# Altium schematic sheet PROC106B_FLASH_USB_TO_UART.SchDoc: FLASH&USB_TO_UART
size 431 x 279 mm; Date: Not shown in title block; ApprovedBy: Not shown in title block; CheckedBy: Not shown in title block; Author: Not shown in title block; CompanyName: Not shown in title block; DrawnBy: Antony/Anand Ram; Engineer: Not shown in title block; Organization: Not shown in title block; Address1: Not shown in title block; Address2: Not shown in title block; Address3: Not shown in title block; Address4: Not shown in title block; DocumentNumber: 6; Revision: Use project parameter SCH_Rev; SheetNumber: 6; SheetTotal: 12; PageSetup: Record=PageOptions|CenterHorizontal=True|CenterVertical=True|PrintScale=1.00|XCorrection=1.00|YCorrection=1.00|PrintKind=0|BorderSize=5000000|LeftOffset=0|BottomOffset=0|Orientation=2|PaperLength=1000|PaperWidth=1000|Scale=100|PaperSource=15|PrintQuality=600|MediaType=1|DitherType=10|PaperKind=Letter|PrintScaleMode=1; CurrentTime: Not shown in title block; CurrentDate: Not shown in title block; Time: Not shown in title block; DocumentFullPathAndName: Not shown in title block; DocumentName: Not shown in title block; ModifiedDate: Not shown in title block; ImagePath: Not shown in title block
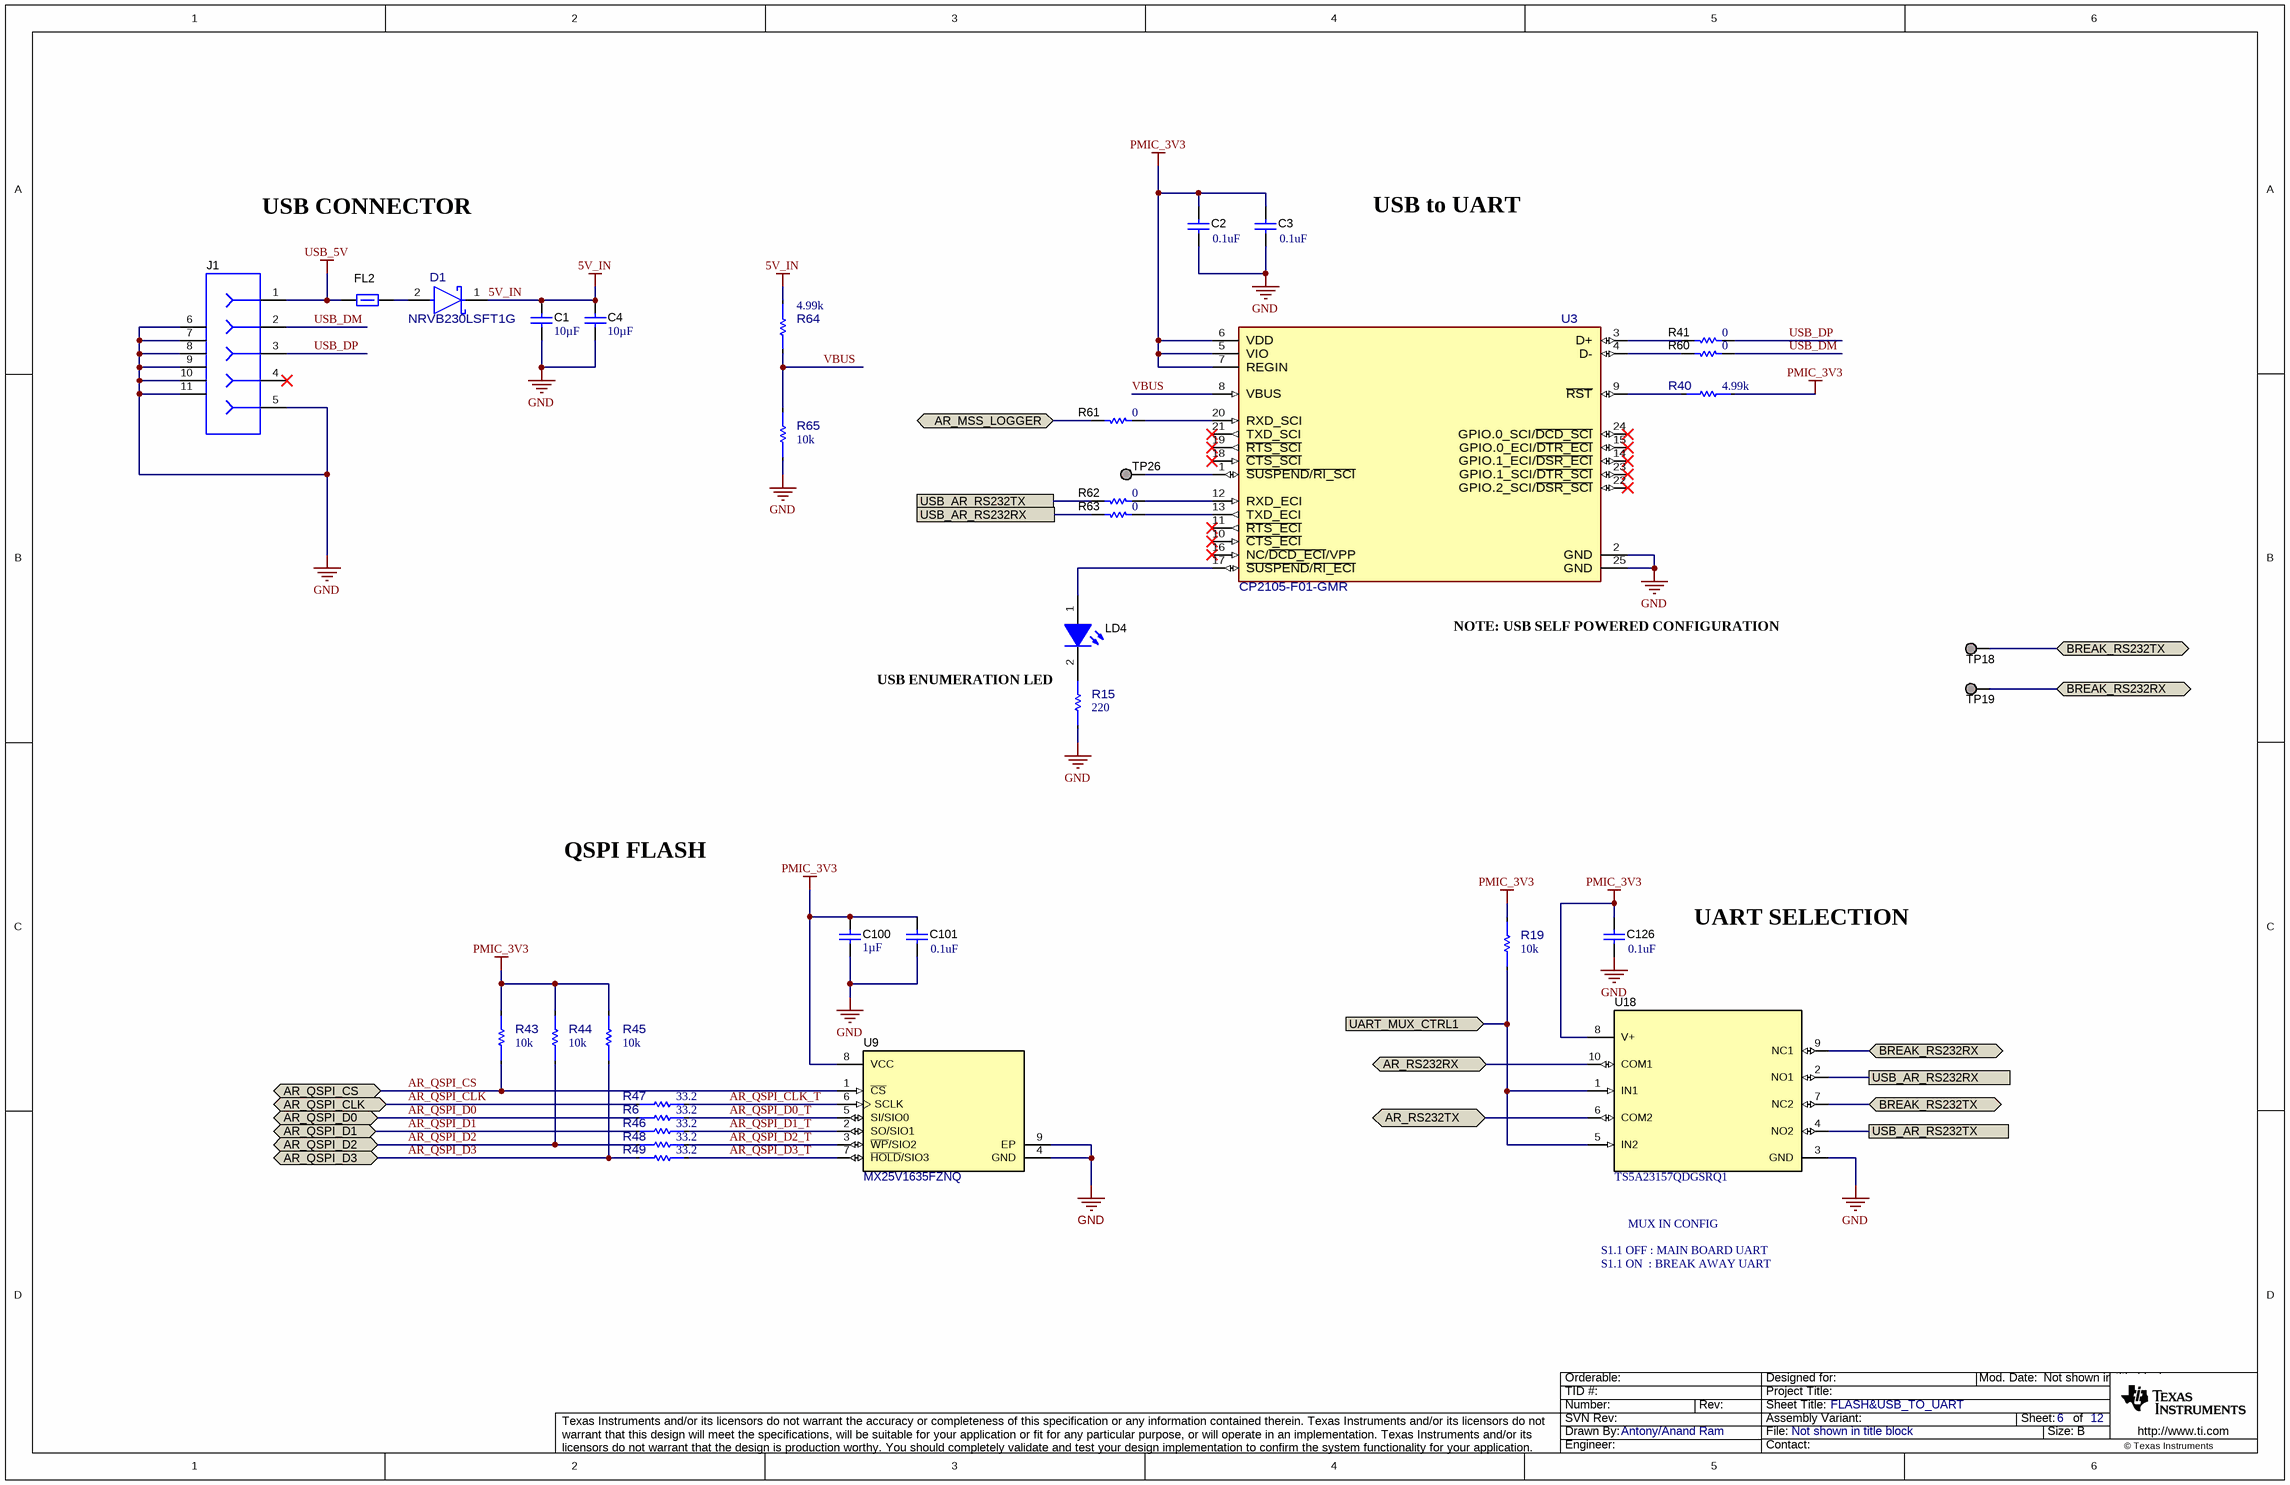
[diagram p0: PROC106B_FLASH_USB_TO_UART.SchDoc]

## Parts
C1  Cap_F: 10µF  [0805L]  (hidden comment: GCM21BR71A106KE22L)
C2  ValueDisplayed: 0.1uF  [0402L]  (hidden comment: GCM155R71C104KA55D)
C3  ValueDisplayed: 0.1uF  [0402L]  (hidden comment: GCM155R71C104KA55D)
C4  Cap_F: 10µF  [0805L]  (hidden comment: GCM21BR71A106KE22L)
C100  Cap_F: 1µF  [0603L]  (hidden comment: GCM188R71C105KA64D)
C101  ValueDisplayed: 0.1uF  [0402L]  (hidden comment: GCM155R71C104KA55D)
C126  ValueDisplayed: 0.1uF  [0402L]  (hidden comment: GCM155R71C104KA55D)
D1  NRVB230LSFT1G  [FP-NRVB230LSFT1G_SOD-123F-MFG]
FL2  BLM15PD300SZ1D  [0402L]  (value not drawn)
J1  105017-0001  [CONN_105017-0001]  (value not drawn)
LD4  APHHS1005CGCK  [APHHS1005_Green]  (value not drawn)
R6  value 33.2  [FP-ERJ-1GNF33R2C_0201-IPC_C]  (hidden comment: ERJ-1GNF33R2C)
R15  value 220  [FP-ERJ-1GNJ221C_0201-IPC_C]  (hidden comment: ERJ-1GNJ221C)
R19  value 10k  [FP-ERA-1AEB103C_0201-IPC_C]  (hidden comment: ERA-1AEB103C)
R40  value 4.99k  [FP-ERJ-1GNF4991C_0201-IPC_C]  (hidden comment: ERJ-1GNF4991C)
R41  ValueDisplayed: 0  [0201L]  (hidden comment: ERJ-1GN0R00C)
R43  value 10k  [FP-ERA-1AEB103C_0201-IPC_C]  (hidden comment: ERA-1AEB103C)
R44  value 10k  [FP-ERA-1AEB103C_0201-IPC_C]  (hidden comment: ERA-1AEB103C)
R45  value 10k  [FP-ERA-1AEB103C_0201-IPC_C]  (hidden comment: ERA-1AEB103C)
R46  value 33.2  [FP-ERJ-1GNF33R2C_0201-IPC_C]  (hidden comment: ERJ-1GNF33R2C)
R47  value 33.2  [FP-ERJ-1GNF33R2C_0201-IPC_C]  (hidden comment: ERJ-1GNF33R2C)
R48  value 33.2  [FP-ERJ-1GNF33R2C_0201-IPC_C]  (hidden comment: ERJ-1GNF33R2C)
R49  value 33.2  [FP-ERJ-1GNF33R2C_0201-IPC_C]  (hidden comment: ERJ-1GNF33R2C)
R60  ValueDisplayed: 0  [0201L]  (hidden comment: ERJ-1GN0R00C)
R61  ValueDisplayed: 0  [0201L]  (hidden comment: ERJ-1GN0R00C)
R62  ValueDisplayed: 0  [0201L]  (hidden comment: ERJ-1GN0R00C)
R63  ValueDisplayed: 0  [0201L]  (hidden comment: ERJ-1GN0R00C)
R64  value 4.99k  [FP-ERJ-1GNF4991C_0201-IPC_C]  (hidden comment: ERJ-1GNF4991C)
R65  value 10k  [FP-ERA-1AEB103C_0201-IPC_C]  (hidden comment: ERA-1AEB103C)
TP18  TESTPOINT  [TP_25MIL-SMT]  (value not drawn)  (no BOM)
TP19  TESTPOINT  [TP_25MIL-SMT]  (value not drawn)  (no BOM)
TP26  TESTPOINT  [TP_25MIL-SMT]  (value not drawn)  (no BOM)
U3  CP2105-F01-GMR  [FP-CP2105-F01-GMR_QFN24-EP-IPC_A]
U9  MX25V1635FZNQ  [WSON-8L_6x5MM_EP]
U18  TS5A23157QDGSRQ1  [DGS0010A_L]

## Ports
AR_MSS_LOGGER (bidir), AR_QSPI_CLK (bidir), AR_QSPI_CS (bidir), AR_QSPI_D0 (bidir), AR_QSPI_D1 (bidir), AR_QSPI_D2 (bidir), AR_QSPI_D3 (bidir), AR_RS232RX (bidir), AR_RS232TX (bidir), BREAK_RS232RX (bidir), BREAK_RS232TX (bidir), UART_MUX_CTRL1 (in), USB_AR_RS232RX, USB_AR_RS232TX

## Nets
5V_IN: C1.2 C4.1 D1.1(CATHODE) R64.1
GND: C1.1 C2.2 C3.2 C4.2 C100.1 C101.1 C126.1 J1.5 J1.6 J1.7 J1.8 J1.9 J1.10 J1.11 R15.1 R65.1 U3.2(GND) U3.25(GND) U9.4(GND) U9.9(EP) U18.3(GND)
PMIC_3V3: C2.1 C3.1 C100.2 C101.2 C126.2 R19.2 R40.1 R43.2 R44.2 R45.2 U3.5(VIO) U3.6(VDD) U3.7(REGIN) U9.8(VCC) U18.8(V+)
USB_5V: FL2.1 J1.1
AR_MSS_LOGGER: R61.1 ; port AR_MSS_LOGGER
AR_QSPI_CLK: R47.1 ; port AR_QSPI_CLK
AR_QSPI_CLK_T: R47.2 U9.6(SCLK)
AR_QSPI_CS: R43.1 U9.1(~{CS}) ; port AR_QSPI_CS
AR_QSPI_D0: R6.1 ; port AR_QSPI_D0
AR_QSPI_D0_T: R6.2 U9.5(SI/SIO0)
AR_QSPI_D1: R46.1 ; port AR_QSPI_D1
AR_QSPI_D1_T: R46.2 U9.2(SO/SIO1)
AR_QSPI_D2: R44.1 R48.1 ; port AR_QSPI_D2
AR_QSPI_D2_T: R48.2 U9.3(~{WP}/SIO2)
AR_QSPI_D3: R45.1 R49.1 ; port AR_QSPI_D3
AR_QSPI_D3_T: R49.2 U9.7(~{HOLD}/SIO3)
AR_RS232RX: U18.10(COM1) ; port AR_RS232RX
AR_RS232TX: U18.6(COM2) ; port AR_RS232TX
BREAK_RS232RX: TP19.1 U18.9(NC1) ; port BREAK_RS232RX
BREAK_RS232TX: TP18.1 U18.7(NC2) ; port BREAK_RS232TX
UART_MUX_CTRL1: R19.1 U18.1(IN1) U18.5(IN2) ; port UART_MUX_CTRL1
USB_AR_RS232RX: R63.1 U18.2(NO1) ; port USB_AR_RS232RX
USB_AR_RS232TX: R62.1 U18.4(NO2) ; port USB_AR_RS232TX
USB_DM: J1.2 R60.2
USB_DP: J1.3 R41.2
VBUS: R64.2 R65.2 U3.8(VBUS)
NetD1_2: D1.2(ANODE) FL2.2
NetLD4_1: LD4.1(A) U3.17(~{SUSPEND}/~{RI_ECI})
NetLD4_2: LD4.2(K) R15.2
NetR40_2: R40.2 U3.9(~{RST})
NetR41_1: R41.1 U3.3(D+)
NetR60_1: R60.1 U3.4(D-)
NetR61_2: R61.2 U3.20(RXD_SCI)
NetR62_2: R62.2 U3.12(RXD_ECI)
NetR63_2: R63.2 U3.13(TXD_ECI)
NetTP26_1: TP26.1 U3.1(~{SUSPEND}/~{RI_SCI})

Not connected (* = marked no-connect by the designer): J1 4*; U3 10(~{CTS_ECI})* 11(~{RTS_ECI})* 14(GPIO.1_ECI/~{DSR_ECI})* 15(GPIO.0_ECI/~{DTR_ECI})* 16(NC/~{DCD_ECI}/VPP)* 18(~{CTS_SCI})* 19(~{RTS_SCI})* 21(TXD_SCI)* 22(GPIO.2_SCI/~{DSR_SCI})* 23(GPIO.1_SCI/~{DTR_SCI})* 24(GPIO.0_SCI/~{DCD_SCI})*

## Notes on the sheet
- USB CONNECTOR
- USB to UART
- (near U3) NOTE: USB SELF POWERED CONFIGURATION
- USB ENUMERATION LED
- QSPI FLASH
- UART SELECTION
- MUX IN CONFIG
- S1.1 ON  : BREAK AWAY UART
- S1.1 OFF : MAIN BOARD UART
- Drawn By:
- SVN Rev:
- Number:
- TID #:
- Orderable:
- Rev:
- Sheet Title:
- File:
- Project Title:
- Designed for:
- Assembly Variant:
- Mod. Date:
- Sheet:
- Size:
- of
- B
- http://www.ti.com
- Texas Instruments and/or its licensors do not warrant the accuracy or completeness of this specification or any information contained therein. Texas Instruments and/or its licensors do not warrant that this design will meet the specifications, will be suitable for your application or fit for any particular purpose, or will operate in an implementation. Texas Instruments and/or its licensors do not warrant that the design is production worthy. You should completely validate and test your design implementation to confirm the system functionality for your application.
- Engineer:
- Contact:
- © Texas Instruments

## Library data of the parts
C1 C4 = CMP-0008017-2: CAP, CERM, 10 uF, 10 V, +/- 10%, X7R, 0805; Manufacturer: MuRata; Value: 10uF; AEC Category: Q200; Cap_Case: 0805; Polarized: N; SizeArea_mm2: 2.5; SizeAreaWB_mm2: 6.75; SizeX_mm: 2; SizeY_mm: 1.25; SizeZ_mm: 1.45; TaMax_C: 125°C; TaMin_C: -55°C; U/M: EA; Value1: Unknown; Value2: 10V; RoHS: Y; AEC Qualified: ?; ComponentLink1Description: Datasheet link; ComponentLink1URL: http://www.murata.com/products/catalog/pdf/c03e.pdf; CompType: Capacitor; MountType: SMT; PackageReference: 0805; PartNumber: GCM21BR71A106KE22L; Supplier 1: Digi-Key; Supplier 2: Newark; Supplier 3: Mouser; Supplier Part Number 1: 490-10674-1-ND; Supplier Part Number 2: 06AC6014; Supplier Part Number 3: 81-GCM21BR71A106KE2L; Technology: Ceramic; TempCo: X7R; Tolerance_%: 10%; ValueDisplayed: 10uF; VDC_V: 10V; LatestRevisionDate: 2017-03-09; Published: 2008-06-19; Publisher: Texas Instruments
C2 C3 C101 C126 = CMP-0006351-2: CAP, CERM, 0.1 uF, 16 V, +/- 10%, X7R, 0402; Manufacturer: MuRata; Cap_F: 100nF; SizeZ_mm: 0.6; VDC_V: 16V; AEC Category: Q200; Cap_Case: 0402; Polarized: N; SizeArea_mm2: 0.5; SizeAreaWB_mm2: 3; SizeX_mm: 1; TaMax_C: 125°C; TaMin_C: -55°C; U/M: EA; Value1: Unknown; Value: 0.1uF; RoHS: Y; AEC Qualified: ?; ComponentLink1Description: Datasheet link; ComponentLink1URL: http://psearch.murata.com/capacitor/product/GCM155R71C104KA55%23.pdf; PackageReference: 0402; PartNumber: GCM155R71C104KA55D; TempCo: X7R; Tolerance_%: 10%; CompType: Capacitor; MountType: SMT; SizeY_mm: 0.5; Supplier 1: Digi-Key; Supplier Part Number 1: 490-4759-2-ND; Technology: Ceramic; Value2: 16V; LatestRevisionDate: 2017-03-09; Published: 2008-06-19; Publisher: Texas Instruments
C100 = CMP-0007136-5: CAP, CERM, 1 uF, 16 V, +/- 10%, X7R, AEC-Q200 Grade 1, 0603; Manufacturer: MuRata; AEC Qualified: Y; SizeZ_mm: 1; VDC_V: 16V; AEC Category: Q200; Cap_Case: 0603; Polarized: N; SizeArea_mm2: 1.28; SizeAreaWB_mm2: 4.68; SizeX_mm: 1.6; SizeY_mm: 0.8; TaMax_C: 125°C; TaMin_C: -55°C; U/M: EA; Value1: Unknown; Value: 1uF; RoHS: Y; ComponentLink1Description: Datasheet link; ComponentLink1URL: http://psearch.en.murata.com/capacitor/product/GCM188R71C105KA64%23.pdf; PackageReference: 0603; PartNumber: GCM188R71C105KA64D; TempCo: X7R; Tolerance_%: 10%; AEC Grade: 1; CompType: Capacitor; MountType: SMT; Supplier 1: Digi-Key; Supplier 2: Mouser; Supplier Part Number 1: 490-5241-6-ND; Supplier Part Number 2: 81-GCM188R71C105K64D; Technology: Ceramic; Value2: 16V; ValueDisplayed: 1uF; LatestRevisionDate: 2017-03-09; Published: 2008-06-19; Publisher: Texas Instruments
D1 = CMP-0090508-1: Diode Schottky 30V 2A Surface Mount SOD-123FL; Manufacturer: ON Semiconductor; TJmax_C: 125°C; SizeZ_mm: 0.98mm; AEC Qualified: Yes; AEC Grade: Grade 1; Max Surge Forward Current: 40A; Peak Reverse Current: 1mA; Standoff Height: 0mm; PackageReference: SOD-123F; RoHS: TRUE; PartNumber: NRVB230LSFT1G; ComponentLink1Description: Datasheet; Vr_V: 30V; ComponentLink1URL: https://www.onsemi.com/pub/Collateral/MBR230LSFT1-D.PDF; Vf_V: 30V; datasheet: https://www.onsemi.com/pub/Collateral/MBR230LSFT1-D.PDF; Datasheet Path: datasheets/Diode-NRVB230LSFT1G.pdf; Digikey Description: DIODE SCHOTTKY 30V 2A SOD123FL; Digikey Part Number: NRVB230LSFT1GOSCT-ND; Forward Current: 2A; helpURL: https://upverter.com/upn/revision/b5ae5ffadf60f179/; Lead Free: Yes; Mouser Description: Schottky Diodes & Rectifiers 2A 30V SCHOTTKY; Mouser Part Number: 863-NRVB230LSFT1G; Operating Temperature Range: -55°C to +125°C; Part Number: NRVB230LSFT1G
FL2 = CMP-0078934-1: Inductor, Ferrite Bead, Ferrite, 2.2 A, 0.035 ohm, AEC-Q200 Grade 1, SMD; Manufacturer: MuRata; AEC Category: Q200; AEC Grade: 1; AEC Qualified: Y; DCR_ohm: 0.035; Imax_A: 2.2A; SizeArea_mm2: 0.5; SizeAreaWB_mm2: 3; SizeZ_mm: 0.6; RoHS: Y; ComponentLink1Description: Datasheet link; ComponentLink1URL: https://www.murata.com/en-us/products/productdata/8796748677150/QNFA9118.pdf; CompType: Inductor; LatestRevisionDate: 2017-12-07; Material: Ferrite; MountType: SMT; PackageReference: 0402; PartNumber: BLM15PD300SZ1D; Published: 2008-06-26; Publisher: Texas Instruments; SizeX_mm: 1; SizeY_mm: 0.5; Supplier 1: Digi-Key; Supplier 2: Mouser; Supplier Part Number 1: 490-16506-1-ND; Supplier Part Number 2: 81-BLM15PD300SZ1D; Technology: Ferrite Bead; Value1: 0.035 ohm; Value2: 2.2A
J1 = CMP-0055293-1: Connector, Receptacle, Micro-USB Type B, R/A, Bottom Mount SMT; Manufacturer: Molex; CNHeader: FALSE; CompType: USB; CT: TRUE; Gender: Female; Green_Lifecycle: Active; Green_REACh: Passed; RoHS: Y; ComponentLink1Description: Datasheet URL; ComponentLink1URL: http://www.molex.com/pdm_docs/sd/1050170001_sd.pdf; Green_EU RoHS-2: Passed; Green_EU RoHS: Passed; LatestRevisionDate: 26/05/2017; MountType: SMT; PackageReference: Micro USB receptacle; PartNumber: 105017-0001; Publisher: Texas Instruments; Supplier 1: Digi-Key; Supplier 2: Newark; Supplier 3: Mouser; Supplier Part Number 1: WM1399CT-ND; Supplier Part Number 2: 78R1699; Supplier Part Number 3: 538-105017-0001
LD4 = CMP-0067682-2: LED, Green, SMD; Manufacturer: Kingbright; Angle: 120.0; Power_TotalModule: 75mW; SizeZ_mm: 0.6; Vf_V: 2.1V; Vr_V: 5V; Io_A: 20mA; Ir_A: 10µA; SizeArea_mm2: 0.5; SizeAreaWB_mm2: 3.0; SizeX_mm: 1.0; Tjmax_C: 85°C; Value1: 0.075W; RoHS: Y; Color: Green; ComponentLink1Description: Datasheet link; ComponentLink1URL: http://www.kingbrightusa.com/images/catalog/SPEC/APHHS1005CGCK.pdf; PackageReference: 0402; PartNumber: APHHS1005CGCK; CompType: LED; MountType: SMT; SizeY_mm: 0.5; Type: ?; Value2: 2.1V; Value: Green
R6 R46-R49 = CMP-0089575-2: Res Thick Film 0201 33.2 Ohm 1% 0.05W(1/20W) ±200ppm/C Pad SMD Automotive T/R; Manufacturer: Panasonic; AEC Grade: Grade 1; AEC Qualified: Yes; Power_W: 50mW; SizeZ_mm: 0.26mm; TempCo: 200ppm/°C; VDC_V: 25V; RoHS: TRUE; ComponentLink1Description: Datasheet; ComponentLink1URL: https://industrial.panasonic.com/cdbs/www-data/pdf/RDA0000/AOA0000C304.pdf; PackageReference: 0201; PartNumber: ERJ-1GNF33R2C; Res_ohm: 33.2; Supplier 1: Digikey; Supplier 2: Mouser; Supplier Part Number 1: P122945CT-ND; Supplier Part Number 2: 667-ERJ-1GNF33R2C; Technology: Thick Film; Tolerance_%: 1%; datasheet: https://industrial.panasonic.com/cdbs/www-data/pdf/RDA0000/AOA0000C304.pdf; Datasheet Path: datasheets/Res-ERJ-1GNF33R2C.pdf; Digikey Description: RES SMD 33.2 OHM 1% 1/20W 0201; Digikey Part Number: P122945CT-ND; helpURL: https://upverter.com/upn/revision/804e6f7ea13c6b2c/; Lead Free: Yes; Mouser Description: Thick Film Resistors - SMD 0201 33.2ohm 1% HalogenFree AEC-Q200; Mouser Part Number: 667-ERJ-1GNF33R2C; Operating Temperature Range: -55°C to +125°C; Part Number: ERJ-1GNF33R2C; Series: ERJ
R15 = CMP-0090501-1: 220 Ohms ±5% 0.05W, 1/20W Chip Resistor 0201 (0603 Metric) Automotive AEC-Q200 Thick Film; Manufacturer: Panasonic Electronic Components; AEC Grade: Grade 1; AEC Qualified: Yes; Power_W: 50mW; SizeZ_mm: 0.26mm; TempCo: 200ppm/°C; VDC_V: 25V; RoHS: TRUE; ComponentLink1Description: Datasheet; ComponentLink1URL: https://industrial.panasonic.com/cdbs/www-data/pdf/RDA0000/AOA0000C301.pdf; PackageReference: 0201; PartNumber: ERJ-1GNJ221C; Res_ohm: 220; Supplier 1: Digikey; Supplier 2: Mouser; Supplier Part Number 1: P123276CT-ND; Supplier Part Number 2: 667-ERJ-1GNJ221C; Technology: Thick Film; Tolerance_%: 5%; datasheet: https://industrial.panasonic.com/cdbs/www-data/pdf/RDA0000/AOA0000C301.pdf; Datasheet Path: datasheets/Res-ERJ-1GNJ221C.pdf; Digikey Description: RES SMD 220 OHM 5% 1/20W 0201; Digikey Part Number: P123276CT-ND; helpURL: https://upverter.com/upn/revision/fb526d048c4bdd68/; Lead Free: Yes; Mouser Description: Thick Film Resistors - SMD 0201 220ohms 5% Thick Film Resistor; Mouser Part Number: 667-ERJ-1GNJ221C; Operating Temperature Range: -55°C to +125°C; Part Number: ERJ-1GNJ221C; Series: ERJ
R19 R43-R45 R65 = CMP-0090084-1: RES SMD 10K OHM 0.1% 1/20W 0201; Manufacturer: Panasonic; AEC Qualified: No; Power_W: 50mW; SizeZ_mm: 0.26mm; TempCo: 25ppm/°C; VDC_V: 25V; RoHS: TRUE; ComponentLink1Description: Datasheet; ComponentLink1URL: https://industrial.panasonic.com/cdbs/www-data/pdf/RDM0000/AOA0000C307.pdf; PackageReference: 0201; PartNumber: ERA-1AEB103C; Res_ohm: 10k; Technology: Thin Film; Tolerance_%: 0.1%; datasheet: https://industrial.panasonic.com/cdbs/www-data/pdf/RDM0000/AOA0000C307.pdf; Datasheet Path: datasheets/Res-ERA-1AEB103C.pdf; Digikey Description: RES SMD 10K OHM 0.1% 1/20W 0201; Digikey Part Number: P10KBXCT-ND; helpURL: https://upverter.com/upn/revision/ad75fa42d92ba837/; Lead Free: Yes; Mouser Part Number: 667-ERA-1AEB103C; Operating Temperature Range: -55°C to +155°C; Part Number: ERA-1AEB103C; Series: ERA; Supplier 1: Digikey; Supplier 2: Mouser; Supplier Part Number 1: P10KBXCT-ND; Supplier Part Number 2: 667-ERA-1AEB103C
R40 R64 = CMP-0090497-1: 4.99 kOhms ±1% 0.05W, 1/20W Chip Resistor 0201 (0603 Metric) Automotive AEC-Q200 Thick Film; Manufacturer: Panasonic Electronic Components; AEC Grade: Grade 1; AEC Qualified: Yes; Power_W: 50mW; SizeZ_mm: 0.26mm; TempCo: 200ppm/°C; VDC_V: 25V; RoHS: TRUE; ComponentLink1Description: Datasheet; ComponentLink1URL: https://industrial.panasonic.com/cdbs/www-data/pdf/RDA0000/AOA0000C304.pdf; PackageReference: 0201; PartNumber: ERJ-1GNF4991C; Res_ohm: 4.99k; Supplier 1: Digikey; Supplier 2: Mouser; Supplier Part Number 1: P123046CT-ND; Supplier Part Number 2: 667-ERJ-1GNF4991C; Technology: Thick Film; Tolerance_%: 1%; datasheet: https://industrial.panasonic.com/cdbs/www-data/pdf/RDA0000/AOA0000C304.pdf; Datasheet Path: datasheets/Res-ERJ-1GNF4991C.pdf; Digikey Description: RES SMD 4.99K OHM 1% 1/20W 0201; Digikey Part Number: P123046CT-ND; helpURL: https://upverter.com/upn/revision/2e32c60b077f8dd5/; Lead Free: Yes; Mouser Description: Thick Film Resistors - SMD 0201 4.99Kohm 1% HalogenFree AEC-Q200; Mouser Part Number: 667-ERJ-1GNF4991C; Operating Temperature Range: -55°C to +125°C; Part Number: ERJ-1GNF4991C; Series: ERJ
R41 R60-R63 = CMP-0065361-1: RES, 0, 5%, .05 W, AEC-Q200 Grade 0, 0201; Manufacturer: Panasonic; AEC Qualified: Y; Power_W: 50mW; SizeZ_mm: 0.26; TempCo: ppm/C; AEC Category: Q200; EIA_Code: E24; Green_Lifecycle: Not Set; Green_REACh: Incomplete; SizeArea_mm2: 0.18; SizeX_mm: 0.6; SizeY_mm: 0.3; U/M: EA; Value2: .05W; Value: 0; Value_Code: 0000; RoHS: Y; ComponentLink1Description: Datasheet link; ComponentLink1URL: https://industrial.panasonic.com/cdbs/www-data/pdf/RDA0000/AOA0000C281.pdf; PackageReference: 0201; PartNumber: ERJ-1GN0R00C; Res_ohm: 0; Technology: Thick Film; Tolerance_%: 5%; AEC Grade: 0; CompType: Resistor; Green_EU RoHS-2: Incomplete; Green_EU RoHS: Incomplete; LatestRevisionDate: 2017-06-05; MountType: SMT; Published: 2016-10-14; Publisher: Texas Instruments; Supplier 1: Digi-Key; Supplier 2: Newark; Supplier 3: Mouser; Supplier Part Number 1: P15979CT-ND; Supplier Part Number 2: 51W5934; Supplier Part Number 3: 667-ERJ-1GN0R00C; Value1: 5%
TP18 TP19 TP26 = CMP-0078143-3: TEST POINT.  No entry in BOM.; CompType: Testpoint; Manufacturer: N/A; PackageReference: N/A; PartNumber: N/A; Library Reference: TESTPOINT
U3 = CMP-0087172-1: I/O Controller Interface IC USB to Dual UART bridge; Manufacturer: Silicon Labs; SizeZ_mm: 0.8mm; RoHS: TRUE; ComponentLink1Description: Datasheet; ComponentLink1URL: https://www.silabs.com/documents/public/data-sheets/CP2105.pdf; PackageReference: QFN24-EP; PartNumber: CP2105-F01-GMR; Symbol Name: SYM-CP2105-F01-GMR
U9 = CMP-0079267-1: 2.3V-3.6V, 16M-BIT [x 1/x 2/x 4] CMOS FLASH Memory, WSON-8; Manufacturer: Macronix International Co., LTD; SizeArea_mm2: 30; SizeAreaWB_mm2: 56; SizeX_mm: 6; SizeY_mm: 5; SizeZ_mm: 0.8; RoHS: Y; ComponentLink1Description: Datasheet URL; ComponentLink1URL: http://www.macronix.com/Lists/Datasheet/Attachments/6724/MX25V1635F,%202.5V,%2016Mb,%20v1.4.pdf; MountType: SMT; PackageReference: WSON-8; PartNumber: MX25V1635FZNQ; Supplier 1: Digi-Key; Supplier Part Number 1: 1092-1211-ND
U18 = CMP-0074341-1: Automotive Catalog Dual 15-Ohm SPDT Analog Switch, DGS0010A (VSSOP-10); Alternate Manufacturer: Texas Instruments; CompType: IC; SizeArea_mm2: 14.7; SizeAreaWB_mm2: 23.6; SizeX_mm: 4.9; SizeY_mm: 3.0; SizeZ_mm: 1.1; U/M: EA; RoHS: Y; ComponentLink1Description: Datasheet Link; ComponentLink1URL: http://www.ti.com/lit/ds/symlink/ts5a23157-q1.pdf; Footprint Path 6: C:\AltiumLibraries\Footprints\TI\.PcbLib; LatestRevisionDate: 2017-06-09; Manufacturer: Texas Instruments; MountType: SMT; PackageDescription: VSSOP-10; PackageReference: DGS0010A; PartNumber: TS5A23157QDGSRQ1; Publisher: Texas Instruments